# EAGLE design usbB_isp_no_lm2940 (EAGLE 6.4)
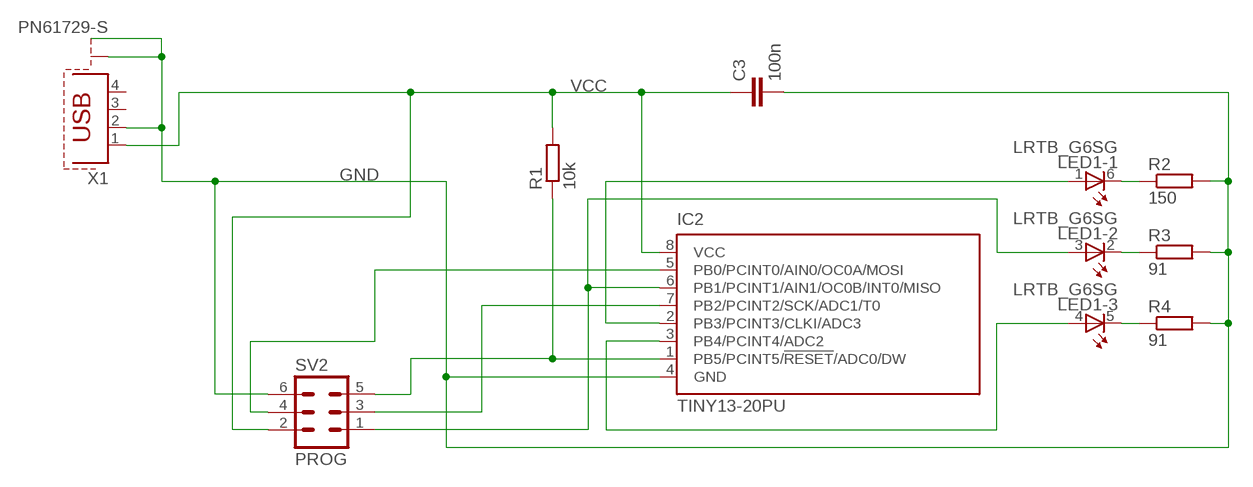
[diagram p0: schematic, sheet 1]

## Parts
C3  100n  C-EU025-025X050  [C025-025X050]
IC2  TINY13-20PU  [DIL08]
LED1  LRTB_G6SG  [LRTB_G6SG]
R1  10k  R-EU_0207/10  [0207/10]
R2  150  R-EU_0207/10  [0207/10]
R3  91  R-EU_0207/10  [0207/10]
R4  91  R-EU_0207/10  [0207/10]
SV2  PROG  ML6  [ML6]
X1  PN61729-S  [PN61729-S]

## Nets
_RESET: IC2.1(PB5/PCINT5/!RESET!/ADC0/DW) R1.1 SV2.5
GND: C3.2 IC2.4(GND) R2.2 R3.2 R4.2 SV2.6 X1.2 X1.S1
MISO: IC2.6(PB1/PCINT1/AIN1/OC0B/INT0/MISO) LED1.3(-2:A) SV2.1
N$3: IC2.2(PB3/PCINT3/CLKI/ADC3) LED1.1(-1:A)
N$6: LED1.5(-3:C) R4.1
N$7: LED1.2(-2:C) R3.1
N$8: LED1.6(-1:C) R2.1
N$9: IC2.3(PB4/PCINT4/ADC2) LED1.4(-3:A)
N$10: IC2.5(PB0/PCINT0/AIN0/OC0A/MOSI) SV2.4
SCK: IC2.7(PB2/PCINT2/SCK/ADC1/T0) SV2.3
VCC: C3.1 IC2.8(VCC) R1.2 SV2.2 X1.1
Unconnected: X1.3 X1.4 X1.S2

## Library data of the parts
C3 = resistor:C-EU: CAPACITOR, European symbol
IC2 = atmel:TINY13: 8-bit AVR Microcontroller with 1K Bytes In-System Programmable Flash Source: http://www.atmel.com/dyn/resources/prod_documents/2535S.pdf; MPN: ATTINY13-20PU; OC_FARNELL: 9171550; OC_NEWARK: 96K6521
LED1 = led:LRTB_G6SG: LRTB G6SG 6-lead TOPLED® Source: OSRAM Opto Semiconductors ... LRTB_G6SG_Pb_free.pdf
R1-R4 = resistor:R-EU_: RESISTOR, European symbol
SV2 = con-ml:ML6: HARTING; OC_FARNELL: unknown; OC_NEWARK: unknown
X1 = con-berg:PN61729-S: BERG USB connector; OC_FARNELL: unknown; OC_NEWARK: unknown

## Net classes
0 default: clearance 0.355 mm

## Board
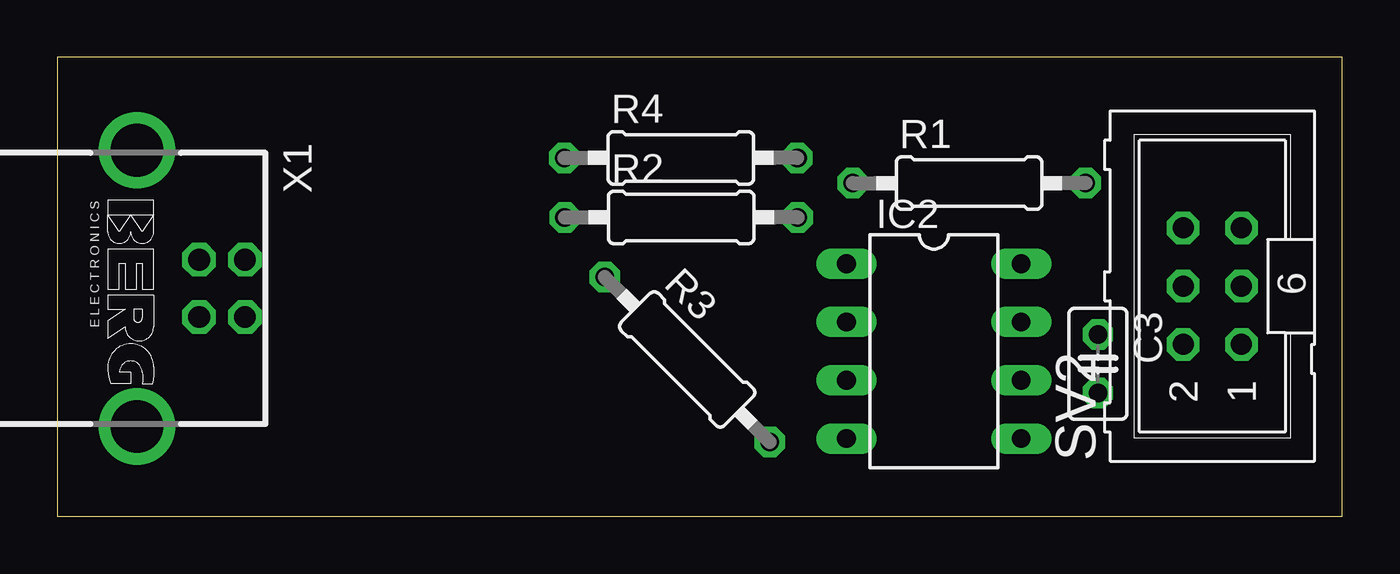
[diagram p1: board, top side]
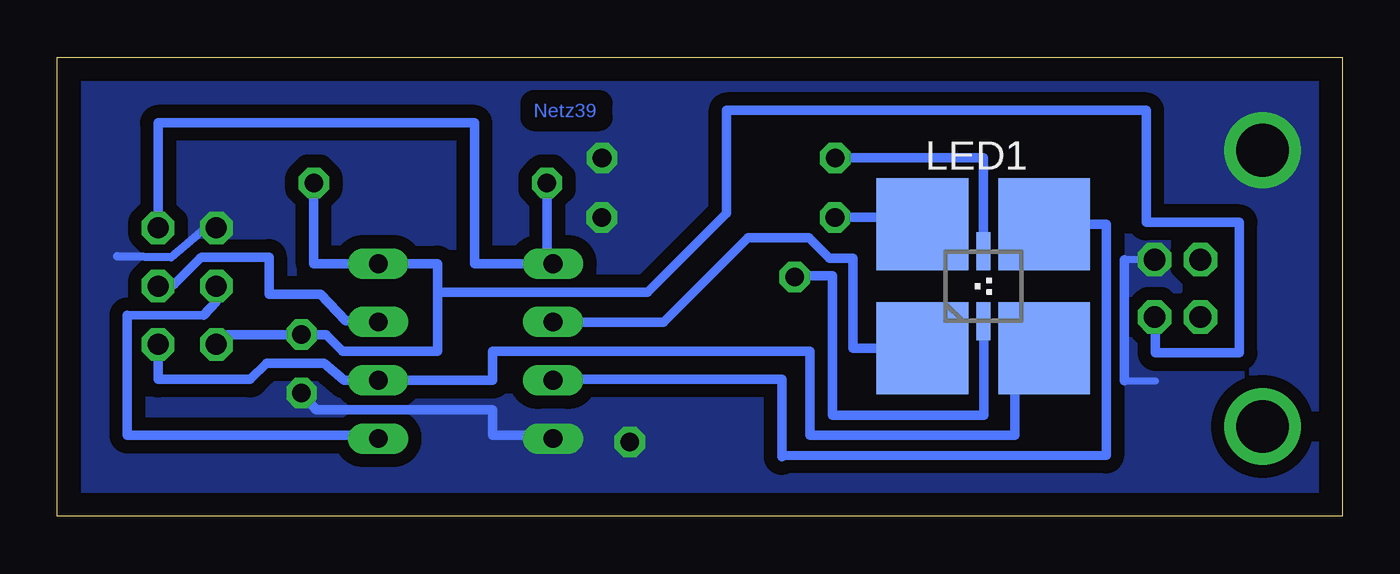
[diagram p2: board, bottom side, seen from below]

Size 56 x 20 mm. Coordinates in mm from the lower left corner, seen from the top.
Outline: 0,0 56,0 56,20 0,20 0,0
Copper layers (1*16): Top 0.035mm / dielectric 1.5mm / Bottom 0.035mm
Design rules "default *": minimum track width 12mil, minimum drill 24mil, track to track 12mil, track to pad 12mil, pad to pad 8mil, via to via 8mil, smd to smd 8mil, copper to edge 40mil, drill to drill 30mil, minimum pad ring 10mil, minimum via ring 8mil, stop-mask expansion 4mil, vias tented up to drill 0mil, thermal gap 10mil

### Footprints (pad centres in the part's own frame; a part is rotated, then mirrored left to right if it is on the bottom)
C025-025X050 = drill 0.813 octagon: 1 -1.27,0; 2 1.27,0
DIL08 = drill 0.813 long: 1 -3.81,-3.81; 2 -1.27,-3.81; 3 1.27,-3.81; 4 3.81,-3.81; 5 3.81,3.81; 6 1.27,3.81; 7 -1.27,3.81; 8 -3.81,3.81
LRTB_G6SG = smd 4 x 4: 1 -2.65,-2.7; 3 2.65,-2.7; 4 2.65,2.7; 6 -2.65,2.7 | smd 0.6 x 1.65: 2 0,-1.525; 5 0,1.525
0207/10 = drill 0.813 octagon: 1 -5.08,0; 2 5.08,0
ML6 = drill 0.914 octagon: 1 -2.54,-1.27; 2 -2.54,1.27; 3 0,-1.27; 4 0,1.27; 5 2.54,-1.27; 6 2.54,1.27
PN61729-S = drill 0.95 octagon: 1 1.25,4.71; 2 -1.25,4.71; 3 -1.25,2.71; 4 1.25,2.71 | drill 2.3 pad 2.9: S1 -6.02,0; S2 6.02,0

### Placement (x,y rotation side)
C3  45.36,6.65 270 top
IC2  38.21,7.2 270 top
LED1  15.64,10.03 0 bottom
R1  39.74,14.52 0 top
R2  27.19,13.03 0 top
R3  27.45,6.84 315 top
R4  27.18,15.62 0 top
SV2  50.34,10.03 90 top
X1  3.47,9.94 270 top

### Tracks (layer width: path | path; a pad name or v marks a point on that pad's centre or on a via)
_RESET
  Bottom 0.406: 51.58,12.61 SV2.5 51.61,17.14 37.82,17.14 37.82,11.01 IC2.1 34.66,11.28 R1.1
GND
  Bottom 0.305: X1.2 9.5,11.19 | 9.5,5.9 8.14,5.9
  Bottom 0.381: 49.47,12.62 51.05,11.3 53.38,11.33
  Bottom 0.406: SV2.6 49.47,12.62 | 34.53,3.53 37.02,3.53 37.02,4.64 44.72,4.64 C3.2 | 9.5,11.19 9.5,5.9
  pour Bottom (isolate 0.584, no thermals): 1,1 1,19 55,19 55,1
MISO
  Bottom 0.406: LED1.3 14.27,7.33 14.27,3.53 23.21,3.53 23.21,7.18 37.02,7.18 37.02,5.93 IC2.6 43.49,5.93 44.36,6.68 46.88,6.68 47.59,5.97 51.61,5.97 SV2.1
N$3
  Bottom 0.406: LED1.1 21.33,7.33 21.33,11.25 22.34,11.25 23.23,12.14 25.9,12.14 29.58,8.46 34.38,8.46 IC2.2
N$6
  Bottom 0.406: LED1.5 15.64,15.62 R4.1
N$7
  Bottom 0.406: LED1.2 15.61,8.5 15.61,4.42 22.22,4.42 22.22,10.49 23.86,10.49 R3.1
N$8
  Bottom 0.406: 18.64,13.03 18.64,14.03 18.29,13.68 LED1.6 18.59,13.03 R2.1
N$9
  Bottom 0.406: LED1.4 10.28,12.74 10.28,2.66 24.43,2.65 | 24.43,2.59 24.43,2.65 | 24.43,2.65 24.43,5.97 34.4,5.97 IC2.3
N$10
  Bottom 0.381: 49.62,8.76 52.95,8.76
  Bottom 0.406: SV2.4 49.07,9.36 49.62,8.76 | 52.95,8.76 52.95,3.53 42.02,3.53 IC2.5
SCK
  Bottom 0.406: 51.58,10.15 51.61,10.12 SV2.3 50.92,10.11 49.78,11.25 49.7,11.3 46.78,11.3 46.78,9.68 44.51,9.68 43.44,8.53 42.07,8.53 IC2.7
VCC
  Bottom 0.406: R1.2 44.82,11.01 IC2.8 39.43,11.01 39.43,9.76 | SV2.2 49.07,7.92 C3.1 44.29,7.92 43.57,7.2 39.42,7.2 39.43,9.76 | X1.1 8.14,8.69 8.14,7.12 4.48,7.12 4.48,12.81 8.54,12.81 8.54,17.69 26.83,17.69 26.83,13.22 30.29,9.76 39.43,9.76

### Text on the board
Bottom: Netz39